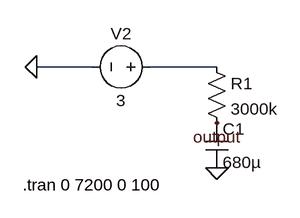
[diagram p0: schematic timer_chip.asc]
timer_chip.asc, the LTspice schematic file:
Version 4
SHEET 1 880 680
WIRE 128 112 48 112
WIRE 304 112 208 112
FLAG 48 112 0
FLAG 304 192 output
FLAG 304 256 0
SYMBOL voltage 224 112 R90
WINDOW 0 -32 56 VBottom 2
WINDOW 3 32 56 VTop 2
WINDOW 123 0 0 Left 0
WINDOW 39 0 0 Left 0
SYMATTR InstName V2
SYMATTR Value 3
SYMBOL cap 288 192 R0
SYMATTR InstName C1
SYMATTR Value 680µ
SYMBOL res 288 96 R0
SYMATTR InstName R1
SYMATTR Value 3000k
TEXT 28 280 Left 2 !.tran 0 7200 0 100

The netlist it stands for:
* timer_chip.asc
V2 N001 0 3
C1 output 0 680µ
R1 N001 output 3000k
.tran 0 7200 0 100
.backanno
.end